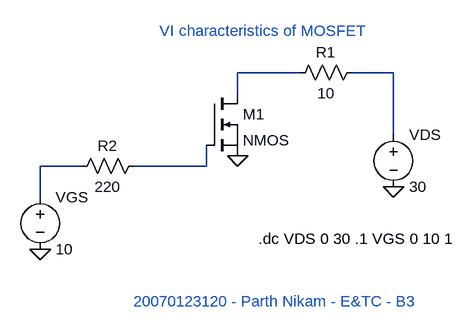
[diagram p0: schematic 1. MOSFET.asc]
1. MOSFET.asc, the LTspice schematic file:
Version 4
SHEET 1 980 680
WIRE 592 224 496 224
WIRE 736 224 672 224
WIRE 496 256 496 224
WIRE 736 320 736 224
WIRE 256 368 192 368
WIRE 448 368 448 336
WIRE 448 368 336 368
WIRE 192 416 192 368
FLAG 192 496 0
FLAG 496 352 0
FLAG 736 400 0
SYMBOL nmos 448 256 R0
SYMATTR InstName M1
SYMBOL res 688 208 R90
WINDOW 0 0 56 VBottom 2
WINDOW 3 32 56 VTop 2
SYMATTR InstName R1
SYMATTR Value 10
SYMBOL res 352 352 R90
WINDOW 0 0 56 VBottom 2
WINDOW 3 32 56 VTop 2
SYMATTR InstName R2
SYMATTR Value 220
SYMBOL voltage 192 400 R0
SYMATTR InstName VGS
SYMATTR Value 10
SYMBOL voltage 736 304 R0
SYMATTR InstName VDS
SYMATTR Value 30
TEXT 528 480 Left 2 !.dc VDS 0 30 .1 VGS 0 10 1
TEXT 336 576 Left 2 ;20070123120 - Parth Nikam - E&TC - B3
TEXT 376 160 Left 2 ;VI characteristics of MOSFET

The netlist it stands for:
* 1. MOSFET.asc
M1 N001 N004 0 0 NMOS
R1 N002 N001 10
R2 N004 N003 220
VGS N003 0 10
VDS N002 0 30
.model NMOS NMOS
.model PMOS PMOS
.lib standard.mos
.dc VDS 0 30 .1 VGS 0 10 1
* 20070123120 - Parth Nikam - E&TC - B3
* VI characteristics of MOSFET
.backanno
.end